# EAGLE schematic 512_outin_arduino (EAGLE 8.5.1)
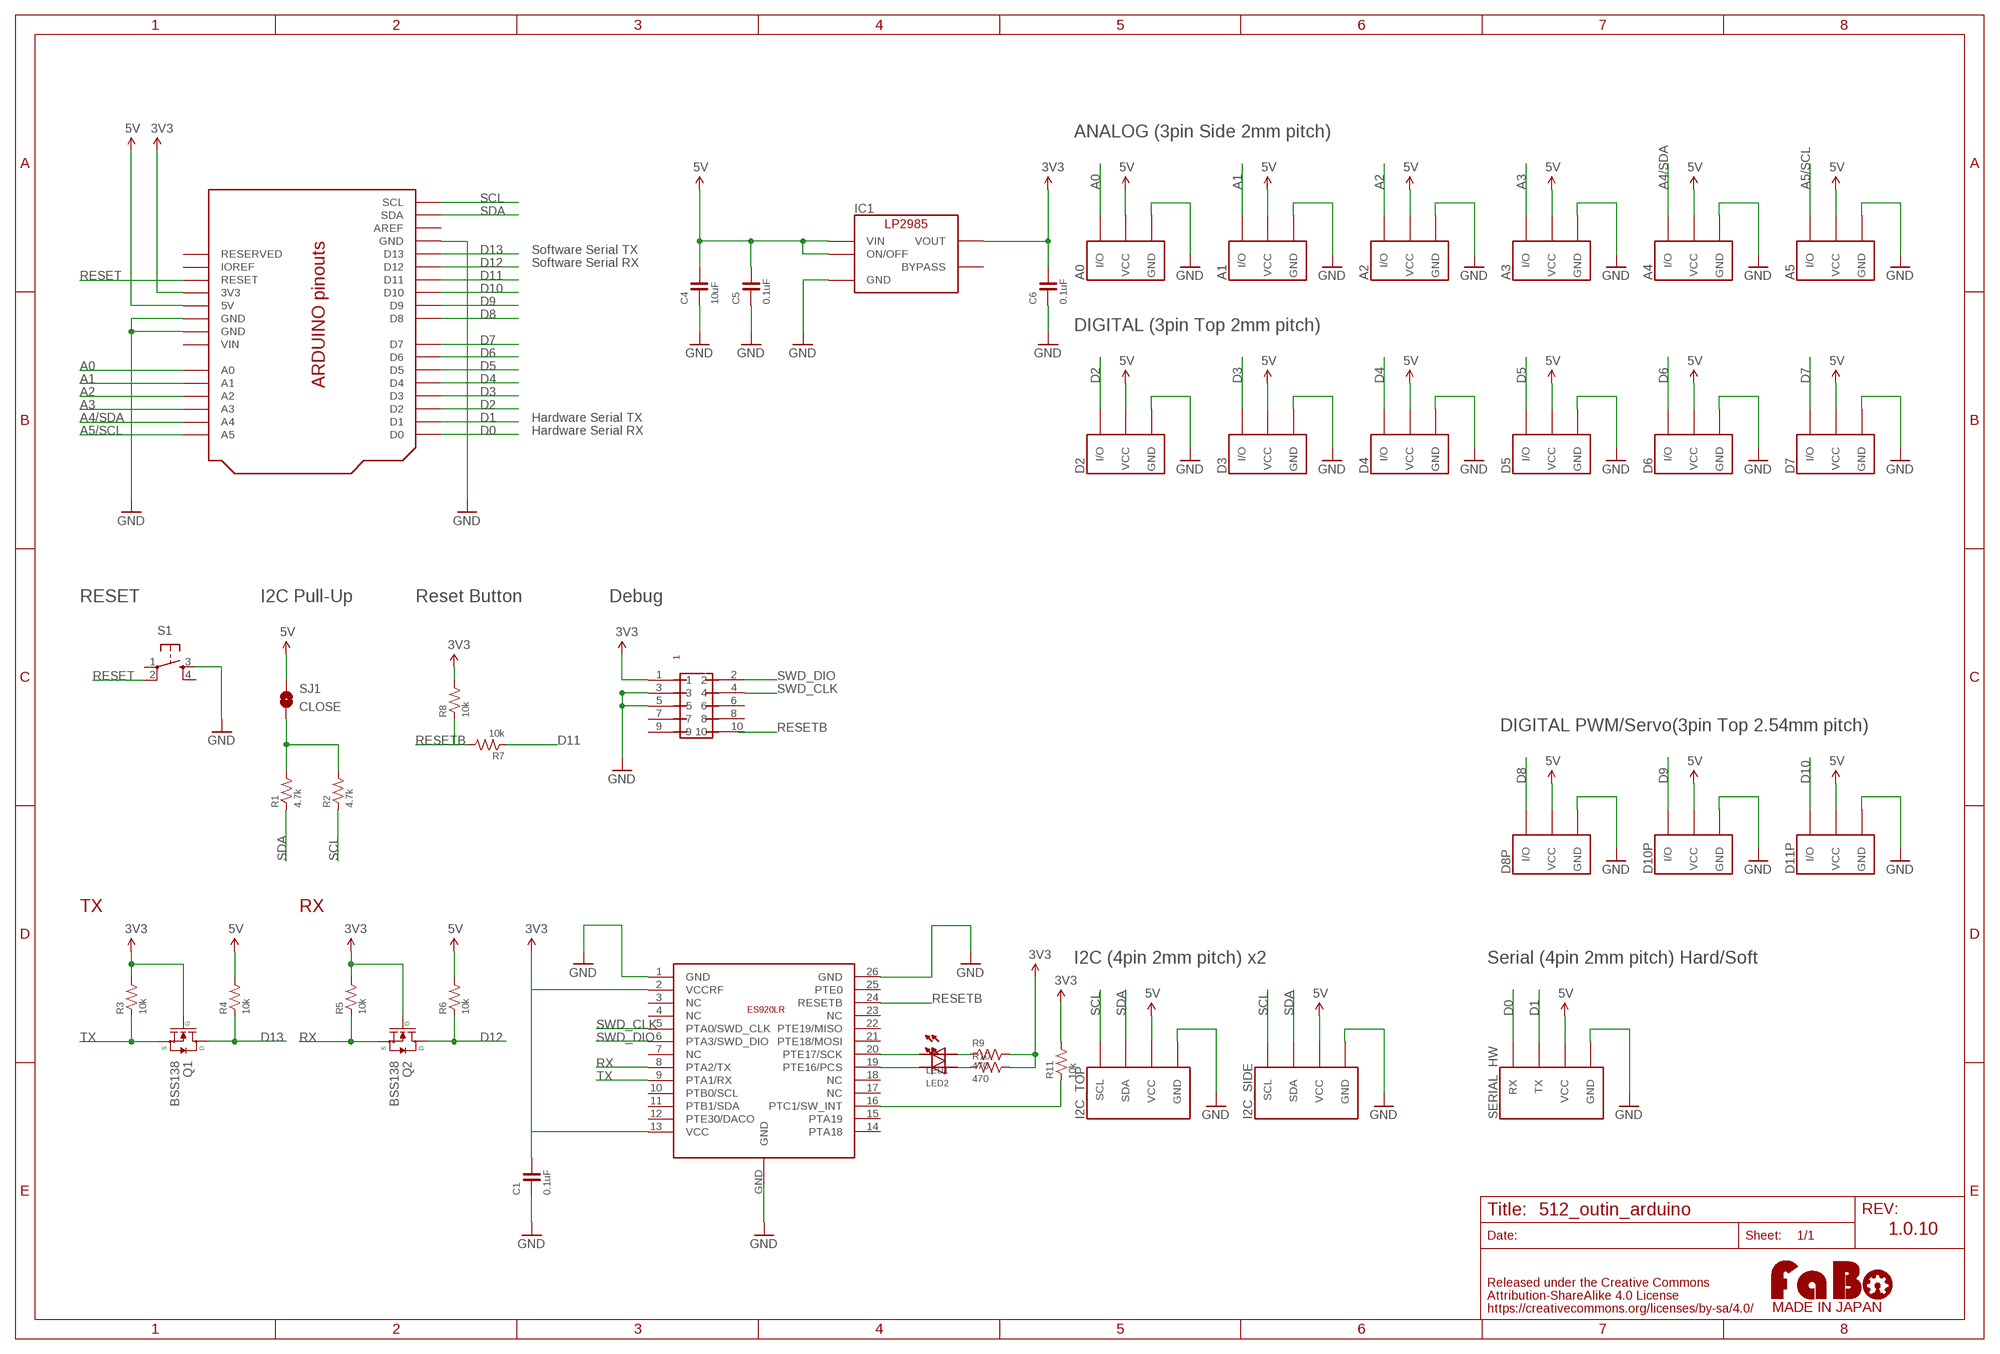
[diagram p0: schematic, sheet 1]

## Parts
A0  FABO_BRICK_3PIN-S03B-PASK-2_LONG  [FABO_BRICK_3PIN_S03B-PASK-2_LONG]
A1  FABO_BRICK_3PIN-S03B-PASK-2_LONG  [FABO_BRICK_3PIN_S03B-PASK-2_LONG]
A2  FABO_BRICK_3PIN-S03B-PASK-2_LONG  [FABO_BRICK_3PIN_S03B-PASK-2_LONG]
A3  FABO_BRICK_3PIN-S03B-PASK-2_LONG  [FABO_BRICK_3PIN_S03B-PASK-2_LONG]
A4  FABO_BRICK_3PIN-S03B-PASK-2_LONG  [FABO_BRICK_3PIN_S03B-PASK-2_LONG]
A5  FABO_BRICK_3PIN-S03B-PASK-2_LONG  [FABO_BRICK_3PIN_S03B-PASK-2_LONG]
C1  0.1uF  CAPACITOR-0603_NARROW  [0603-NARROW]
C4  10uF  CAPACITOR-0603_NARROW  [0603-NARROW]
C5  0.1uF  CAPACITOR-0603_NARROW  [0603-NARROW]
C6  0.1uF  CAPACITOR-0603_NARROW  [0603-NARROW]
D2  FABO_BRICK_3PIN-B03B-PASK-1  [FABO_BRICK_3PIN_B03B-PASK-1]
D3  FABO_BRICK_3PIN-B03B-PASK-1  [FABO_BRICK_3PIN_B03B-PASK-1]
D4  FABO_BRICK_3PIN-B03B-PASK-1  [FABO_BRICK_3PIN_B03B-PASK-1]
D5  FABO_BRICK_3PIN-B03B-PASK-1  [FABO_BRICK_3PIN_B03B-PASK-1]
D6  FABO_BRICK_3PIN-B03B-PASK-1  [FABO_BRICK_3PIN_B03B-PASK-1]
D7  FABO_BRICK_3PIN-B03B-PASK-1  [FABO_BRICK_3PIN_B03B-PASK-1]
D8P  FABO_BRICK_3PIN-HEADER  [FABO_BRICK_3PIN_HEADER]
D10P  FABO_BRICK_3PIN-HEADER  [FABO_BRICK_3PIN_HEADER]
D11P  FABO_BRICK_3PIN-HEADER  [FABO_BRICK_3PIN_HEADER]
I2C_SIDE  FABO_BRICK_I2C-S04B-PASK-2_LONG  [FABO_BRICK_I2C_S04B-PASK-2_LONG]
I2C_TOP  FABO_BRICK_I2C-B04B-PASK-1  [FABO_BRICK_I2C_B04B-PASK-1]
IC1  LP2985-33DBV  [SOT-23-5]
LED1  LED-0603  [0603]
LED2  LED-0603  [0603]
Q1  BSS138  MOSFET-N  [SOT23-3]
Q2  BSS138  MOSFET-N  [SOT23-3]
R1  4.7k  RESISTOR-0603  [0603]
R2  4.7k  RESISTOR-0603  [0603]
R3  10k  RESISTOR-0603-NARROW  [0603-NARROW]
R4  10k  RESISTOR-0603-NARROW  [0603-NARROW]
R5  10k  RESISTOR-0603-NARROW  [0603-NARROW]
R6  10k  RESISTOR-0603-NARROW  [0603-NARROW]
R7  10k  RESISTOR-0603-NARROW  [0603-NARROW]
R8  10k  RESISTOR-0603-NARROW  [0603-NARROW]
R9  470  RESISTOR-0603-NARROW  [0603-NARROW]
R10  470  RESISTOR-0603-NARROW  [0603-NARROW]
R11  10k  RESISTOR-0603-NARROW  [0603-NARROW]
S1  TACT-SWITCH-6MM  [DTS_6_V]
SERIAL_HW  FABO_BRICK_SERIAL-B04B-PASK-1  [FABO_BRICK_SERIAL_B04B-PASK-1]
SJ1  CLOSE  SMD-JUMPER-2-CLOSE  [SMD-JUMPER-2-CLOSE]
U1  ARDUINO_UNO_R3_SHIELD-OUTIN  [ARDUINO_SHIELD_OUTIN]
U$10  LOGO_FABO-M  [LOGO_FABO_MS]
U$15  PIN-HEADER-SMT(1.27MM)2X5  [PIN-HEADER-SMT(1.27MM)2X5]
U$16  ES920LR  [ES920LR]

## Nets
3V3: C1.2 C6.2 IC1.5(VOUT) Q1.1(G) Q2.1(G) R3.2 R5.2 R8.2 R9.2 R10.2 R11.2 U1.3V3 U$15.1 U$16.2(VCCRF) U$16.13(VCC)
5V: A0.VCC A1.VCC A2.VCC A3.VCC A4.VCC A5.VCC C4.2 C5.2 D2.VCC D3.VCC D4.VCC D5.VCC D6.VCC D7.VCC D8P.VCC D10P.VCC D11P.VCC I2C_SIDE.VCC I2C_TOP.VCC IC1.1(VIN) IC1.3(ON/OFF) R4.2 R6.2 SERIAL_HW.VCC SJ1.1 U1.5V
A0: A0.I/O U1.A0
A1: A1.I/O U1.A1
A2: A2.I/O U1.A2
A3: A3.I/O U1.A3
A4/SDA: A4.I/O U1.A4
A5/SCL: A5.I/O U1.A5
D0: SERIAL_HW.RX U1.D0
D1: SERIAL_HW.TX U1.D1
D2: D2.I/O U1.D2
D3: D3.I/O U1.D3
D4: D4.I/O U1.D4
D5: D5.I/O U1.D5
D6: D6.I/O U1.D6
D7: D7.I/O U1.D7
D8: D8P.I/O U1.D8
D9: D10P.I/O U1.D9
D10: D11P.I/O U1.D10
D11: R7.1 U1.D11
D12: Q2.3(D) R6.1 U1.D12
D13: Q1.3(D) R4.1 U1.D13
GND: A0.GND A1.GND A2.GND A3.GND A4.GND A5.GND C1.1 C4.1 C5.1 C6.1 D2.GND D3.GND D4.GND D5.GND D6.GND D7.GND D8P.GND D10P.GND D11P.GND I2C_SIDE.GND I2C_TOP.GND IC1.2(GND) S1.3 SERIAL_HW.GND U1.GND1(GND) U1.GND2(GND) U1.GND3(GND) U$15.3 U$15.5 U$16.1(GND) U$16.26(GND) U$16.GND
N$1: R1.2 R2.2 SJ1.2
N$4: LED2.CATHODE U$16.19(PTE16/PCS)
N$5: LED1.CATHODE U$16.20(PTE17/SCK)
N$6: LED1.ANODE R9.1
N$7: LED2.ANODE R10.1
N$8: R11.1 U$16.16(PTC1/SW_INT)
RESET: S1.2 U1.RESET
RESETB: R7.2 R8.1 U$15.10 U$16.24(RESETB)
RX: Q2.2(S) R5.1 U$16.8(PTA2/TX)
SCL: I2C_SIDE.SCL I2C_TOP.SCL R2.1 U1.SCL
SDA: I2C_SIDE.SDA I2C_TOP.SDA R1.1 U1.SDA
SWD_CLK: U$15.4 U$16.5(PTA0/SWD_CLK)
SWD_DIO: U$15.2 U$16.6(PTA3/SWD_DIO)
TX: Q1.2(S) R3.1 U$16.9(PTA1/RX)
Unconnected: IC1.4(BYPASS) S1.1 S1.4 U1.AREF U1.IOREF U1.RESERVED U$15.6 U$15.7 U$15.8 U$15.9 U$16.3(NC) U$16.4(NC) U$16.7(NC) U$16.10(PTB0/SCL) U$16.11(PTB1/SDA) U$16.12(PTE30/DACO) U$16.14(PTA18) U$16.15(PTA19) U$16.17(NC) U$16.18(NC) U$16.21(PTE18/MOSI) U$16.22(PTE19/MISO) U$16.23(NC) U$16.25(PTE0)

## Notes on the sheet
- ANALOG (3pin Side 2mm pitch)
- Software Serial TX
- Software Serial RX
- DIGITAL (3pin Top 2mm pitch)
- Hardware Serial TX
- Hardware Serial RX
- RESET | I2C Pull-Up | Reset Button | Debug
- DIGITAL PWM/Servo(3pin Top 2.54mm pitch)
- TX | RX
- I2C (4pin 2mm pitch) x2 | Serial (4pin 2mm pitch) Hard/Soft
- 1.0.10

## Power pins joined to a net without a drawn wire
VIN: U1.VIN

## Library data of the parts
A0 A1-A5 D2-D7 D8P D10P D11P = FaBo-Template:FABO_BRICK_3PIN: FaBo Brick 3pin
C1 C4-C6 = FaBo-Capacitor:CAPACITOR: CAPACITOR
I2C_SIDE I2C_TOP = FaBo-Template:FABO_BRICK_I2C: FaBo Brick I2C
IC1 = FaBo-Supply:LP2985: LP2985
LED1 LED2 = FaBo-LED:LED
Q1 Q2 = FaBo-etc:MOSFET-N
R1-R11 = FaBo-Resistors:RESISTOR: RESISTOR
S1 = FaBo-Switch:TACT-SWITCH
SERIAL_HW = FaBo-Template:FABO_BRICK_SERIAL: FaBo Brick Serial
SJ1 = FaBo-Supply:SMD-JUMPER-2
U1 = FaBo-Boards:ARDUINO_UNO_R3_SHIELD
U$10 = FaBo-etc:LOGO_FABO
U$15 = GClue:PIN-HEADER-SMT(1.27MM)2X5: PIN-HEADER-SMT (1.27MM) 2x5
U$16 = FaBo-LoRa:ES920LR